# Altium schematic sheet 4_underglow.SchDoc
size A4
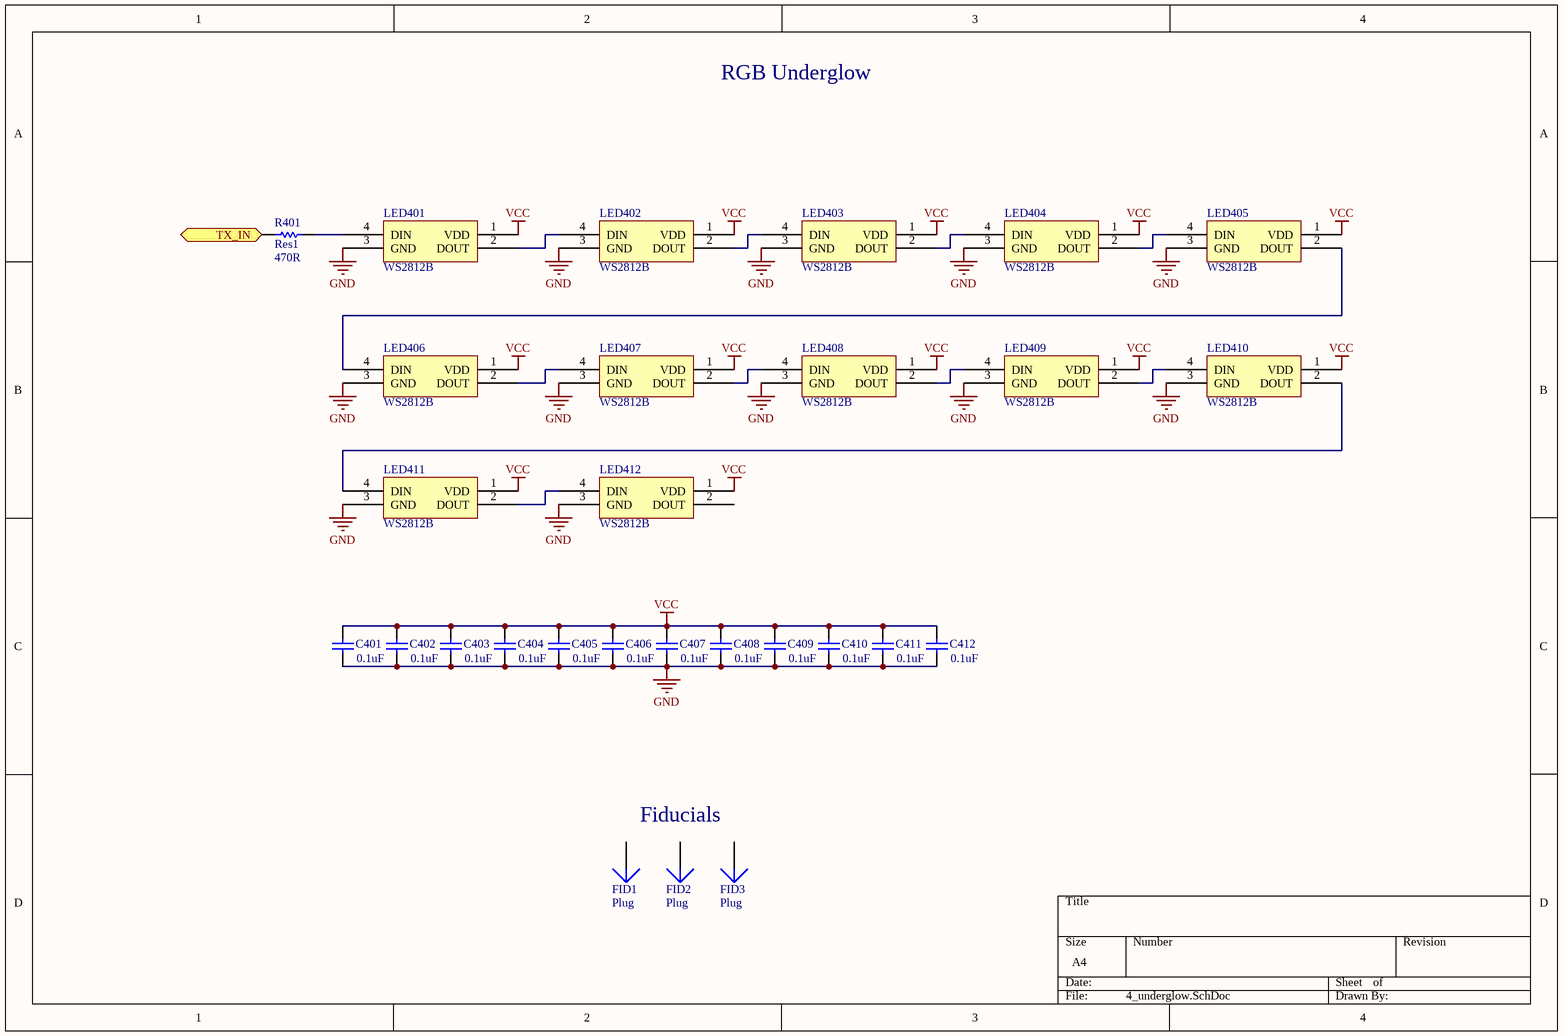
[diagram p0: 4_underglow.SchDoc]

## Parts
C401  value 0.1uF  [C0603[1608]]
C402  value 0.1uF  [C0603[1608]]
C403  value 0.1uF  [C0603[1608]]
C404  value 0.1uF  [C0603[1608]]
C405  value 0.1uF  [C0603[1608]]
C406  value 0.1uF  [C0603[1608]]
C407  value 0.1uF  [C0603[1608]]
C408  value 0.1uF  [C0603[1608]]
C409  value 0.1uF  [C0603[1608]]
C410  value 0.1uF  [C0603[1608]]
C411  value 0.1uF  [C0603[1608]]
C412  value 0.1uF  [C0603[1608]]
FID1  Plug  [Fiducial_Nordic]  (no BOM)
FID2  Plug  [Fiducial_Nordic]  (no BOM)
FID3  Plug  [Fiducial_Nordic]  (no BOM)
LED401  WS2812B  [WS2812B]
LED402  WS2812B  [WS2812B]
LED403  WS2812B  [WS2812B]
LED404  WS2812B  [WS2812B]
LED405  WS2812B  [WS2812B]
LED406  WS2812B  [WS2812B]
LED407  WS2812B  [WS2812B]
LED408  WS2812B  [WS2812B]
LED409  WS2812B  [WS2812B]
LED410  WS2812B  [WS2812B]
LED411  WS2812B  [WS2812B]
LED412  WS2812B  [WS2812B]
R401  Res1  value 470R  [R0603[1608]]

## Ports
TX_IN

## Nets
GND: C401.1 C402.1 C403.1 C404.1 C405.1 C406.1 C407.1 C408.1 C409.1 C410.1 C411.1 C412.1 LED401.3(GND) LED402.3(GND) LED403.3(GND) LED404.3(GND) LED405.3(GND) LED406.3(GND) LED407.3(GND) LED408.3(GND) LED409.3(GND) LED410.3(GND) LED411.3(GND) LED412.3(GND)
VCC: C401.2 C402.2 C403.2 C404.2 C405.2 C406.2 C407.2 C408.2 C409.2 C410.2 C411.2 C412.2 LED401.1(VDD) LED402.1(VDD) LED403.1(VDD) LED404.1(VDD) LED405.1(VDD) LED406.1(VDD) LED407.1(VDD) LED408.1(VDD) LED409.1(VDD) LED410.1(VDD) LED411.1(VDD) LED412.1(VDD)
TX_IN: R401.1 ; port TX_IN
NetLED401_2: LED401.2(DOUT) LED402.4(DIN)
NetLED401_4: LED401.4(DIN) R401.2
NetLED402_2: LED402.2(DOUT) LED403.4(DIN)
NetLED403_2: LED403.2(DOUT) LED404.4(DIN)
NetLED404_2: LED404.2(DOUT) LED405.4(DIN)
NetLED405_2: LED405.2(DOUT) LED406.4(DIN)
NetLED406_2: LED406.2(DOUT) LED407.4(DIN)
NetLED407_2: LED407.2(DOUT) LED408.4(DIN)
NetLED408_2: LED408.2(DOUT) LED409.4(DIN)
NetLED409_2: LED409.2(DOUT) LED410.4(DIN)
NetLED410_2: LED410.2(DOUT) LED411.4(DIN)
NetLED411_2: LED411.2(DOUT) LED412.4(DIN)

Not connected (* = marked no-connect by the designer): FID1 1; FID2 1; FID3 1; LED412 2(DOUT)

## Notes on the sheet
- RGB Underglow
- Fiducials

## Library data of the parts
C401-C412 = Cap: Capacitor; MRF.Part: CC0603KRX7R9BB104; MFG: KEMET; MFGPN: C0603C104M5RACTU; LCSC MFG: YAGEO; Version: 0603 imperial; LCSCPN: C14663
LED401-LED412 = WS2812B: MRF.Part: WS2812B-B; LCSC MFG: Worldsemi; LCSCPN: C114586; Version: 5x5mm
R401 = Res1: Resistor; MRF.Part: 0603WAF4700T5E; LCSC MFG: Uniroyal Elec; Version: 0603 imperial; LCSCPN: C23179